# EAGLE design Static Test Pad (EAGLE 9.6.2)
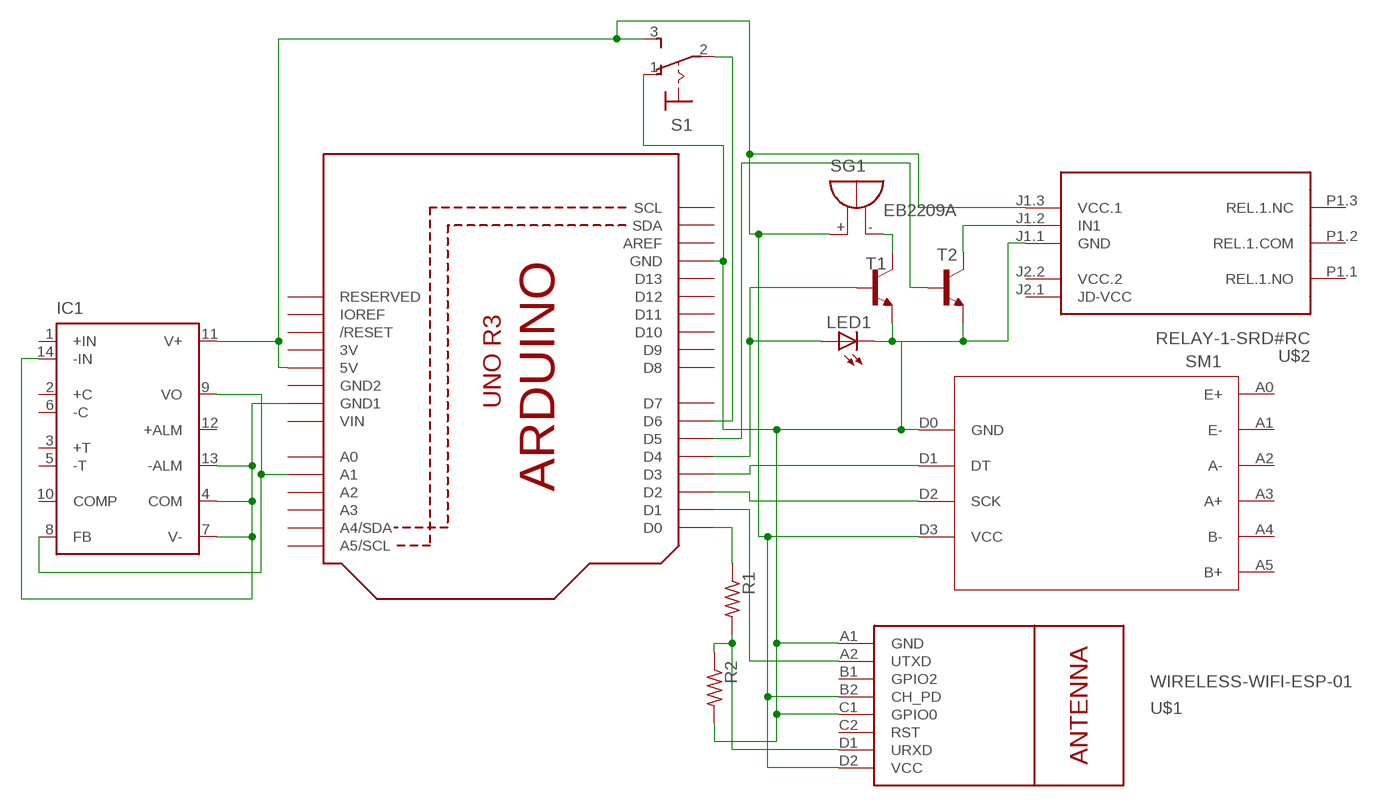
[diagram p0: schematic, sheet 1]

## Parts
IC1  AD595  [DIL14]
LED1  LEDB155  [Q62902-B155]
R1  FLIPFLOP-RES  [0805-THM]
R2  FLIPFLOP-RES  [0805-THM]
S1  320-916  [320-916]
SG1  EB2209A  [EB2209A]
SM1  HX711  [HX711]
T1  2N3700-NPN-TO18-EBC  [TO18]
T2  2N3700-NPN-TO18-EBC  [TO18]
U1  ARDUINOR3-BPLACE  [ARDUINOR3-BPLACE]
U$1  WIRELESS-WIFI-ESP-01  [WIRELESS-WIFI-ESP-01]
U$2  RELAY-1-SRD#RC  [RELAY-1-SRD#RC]

## Nets
N$1: IC1.8(FB) IC1.9(VO) U1.A1
N$2: IC1.4(COM) IC1.7(V-) IC1.13(-ALM) IC1.14(-IN) U1.GND1
N$3: S1.2(P) U1.D6
N$4: LED1.K(C) R2.2 S1.1(O) SM1.D0(GND) T1.1(E) T2.1(E) U1.GND U$1.A1(GND) U$1.C1(GPIO0) U$2.J1.1(GND)
N$5: SG1.- T1.3(C)
N$6: T2.2(B) U1.D5
N$7: LED1.A T1.2(B) U1.D4
N$8: R1.2 R2.1 U$1.D1(URXD)
N$9: U1.D1 U$1.A2(UTXD)
N$10: T2.3(C) U$2.J1.2(IN1)
N$11: SM1.D1(DT) U1.D3
N$12: SM1.D2(SCK) U1.D2
N$13: IC1.11(V+) S1.3(S) SG1.+ SM1.D3(VCC) U1.5V U$1.B2(CH_PD) U$1.D2(VCC) U$2.J1.3(VCC.1)
N$14: R1.1 U1.D0
Unconnected: IC1.1(+IN) IC1.2(+C) IC1.3(+T) IC1.5(-T) IC1.6(-C) IC1.10(COMP) IC1.12(+ALM) SM1.A0(E+) SM1.A1(E-) SM1.A2(A-) SM1.A3(A+) SM1.A4(B-) SM1.A5(B+) U1.A0 U1.A2 U1.A3 U1.A4(A4/SDA) U1.A5(A5/SCL) U1.AREF U1.D7 U1.D8 U1.D9 U1.D10 U1.D11 U1.D12 U1.D13 U1.IOREF U1.RESERVED U1.RESET(/RESET) U1.SCL U1.SDA U$1.B1(GPIO2) U$1.C2(RST) U$2.J2.1(JD-VCC) U$2.P1.1(REL.1.NO) U$2.P1.2(REL.1.COM) U$2.P1.3(REL.1.NC)

## Power pins joined to a net without a drawn wire
3V: U1.3V
GND2: U1.GND2
VCC.2: U$2.J2.2(VCC.2)
VIN: U1.VIN

## Library data of the parts
IC1 = analog-devices:AD595: ANALOG DEVICES; MPN: AD595AQ; OC_FARNELL: 409194; OC_NEWARK: 06WX1596
LED1 = adafruit:LED: LED OSRAM: - CHIPLED LG R971, LG N971, LY N971, LG Q971, LY Q971, LO R971, LY R971 LH N974, LH R974 LS Q976, LO Q976, LY Q976 LO Q996 - Hyper CHIPLED LW Q18S LB Q993, LB Q99A, LB R99A - SideLED LS A670, LO A670, LY A670, LG A670, LP A670 LB A673, LV A673, LT A673, LW A673 LH A674 LY A675 LS A676, LA A676, LO A676, LY A676, LW A676 LS A679, LY A679, LG A679 - Hyper Micro SIDELED® LS Y876, LA Y876, LO Y876, LY Y876 LT Y87S - SmartLED LW L88C, LW L88S LB L89C, LB L89S, LG L890 LS L89K, LO L89K, LY L89K LS L896, LA L896, LO L896, LY L896 - TOPLED LS T670, LO T670, LY T670, LG T670, LP T670 LSG T670, LSP T670, LSY T670, LOP T670, LYG T670 LG T671, LOG T671, LSG T671 LB T673, LV T673, LT T673, LW T673 LH T674 LS T676, LA T676, LO T676, LY T676, LB T676, LH T676, LSB T676, LW T676 LB T67C, LV T67C, LT T67C, LS T67K, LO T67K, LY T67K, LW E67C LS E67B, LA E67B, LO E67B, LY E67B, LB E67C, LV E67C, LT E67C LW T67C LS T679, LY T679, LG T679 LS T770, LO T770, LY T770, LG T770, LP T770 LB T773, LV T773, LT T773, LW T773 LH T774 LS E675, LA E675, LY E675, LS T675 LS T776, LA T776, LO T776, LY T776, LB T776 LHGB T686 LT T68C, LB T68C - Hyper Mini TOPLED® LB M676 - Mini TOPLED Santana® LG M470 LS M47K, LO M47K, LY M47K Source: http://www.osram.convergy.de/
R1 R2 = adafruit:FLIPFLOP-RES: Flip Flop resistor An 0805 resistor inside a standard 1/4W 5% resistor. Makes for easy mods
S1 = switch:320-916: TOGGLE SWITCH distributor RS Components
SG1 = buzzer:EB2209A: BUZZER Source: Buerklin; OC_FARNELL: unknown; OC_NEWARK: unknown
SM1 = hx711 a:HX711: HX711 module is a Load Cell Amplifier breakout board for the HX711 IC that allows you to easily read load cells to measure weight. This module uses 24 high precision A/D converter chip HX711. It is a specially designed for the high precision electronic scale design, with two analog input channel, the internal integration of 128 times the programmable gain amplifier. The input circuit can be configured to provide a bridge type pressure bridge (such as pressure, weighing sensor mode), is of high precision, low cost is an ideal sampling front-end module.
T1 T2 = transistor:*-NPN-: NPN Transistror BF959 corrected 2008.03.06
U1 = adafruit:ARDUINOR3: This is a new object for the new Arduino R3 - with extra pins that you may want to use (such as IOref, and duplicated A4/A5
U$1 = HC SR04:WIRELESS-WIFI-ESP-01: Wireless Wi-Fi ESP-01 Module based on ESP8266 chip Click here to find device on ebay.com <http://www.ebay.com/sch/esp8266+esp+01+transceiver>
U$2 = HC SR04:RELAY-1-SRD#RC: 1-Channel Relay Module based on SRD-05VDC-SL-C relays Symbol with relays pins Click here to find device on ebay.com <http://www.ebay.com/sch/one+channel+isolated+relay+5v>

## Board
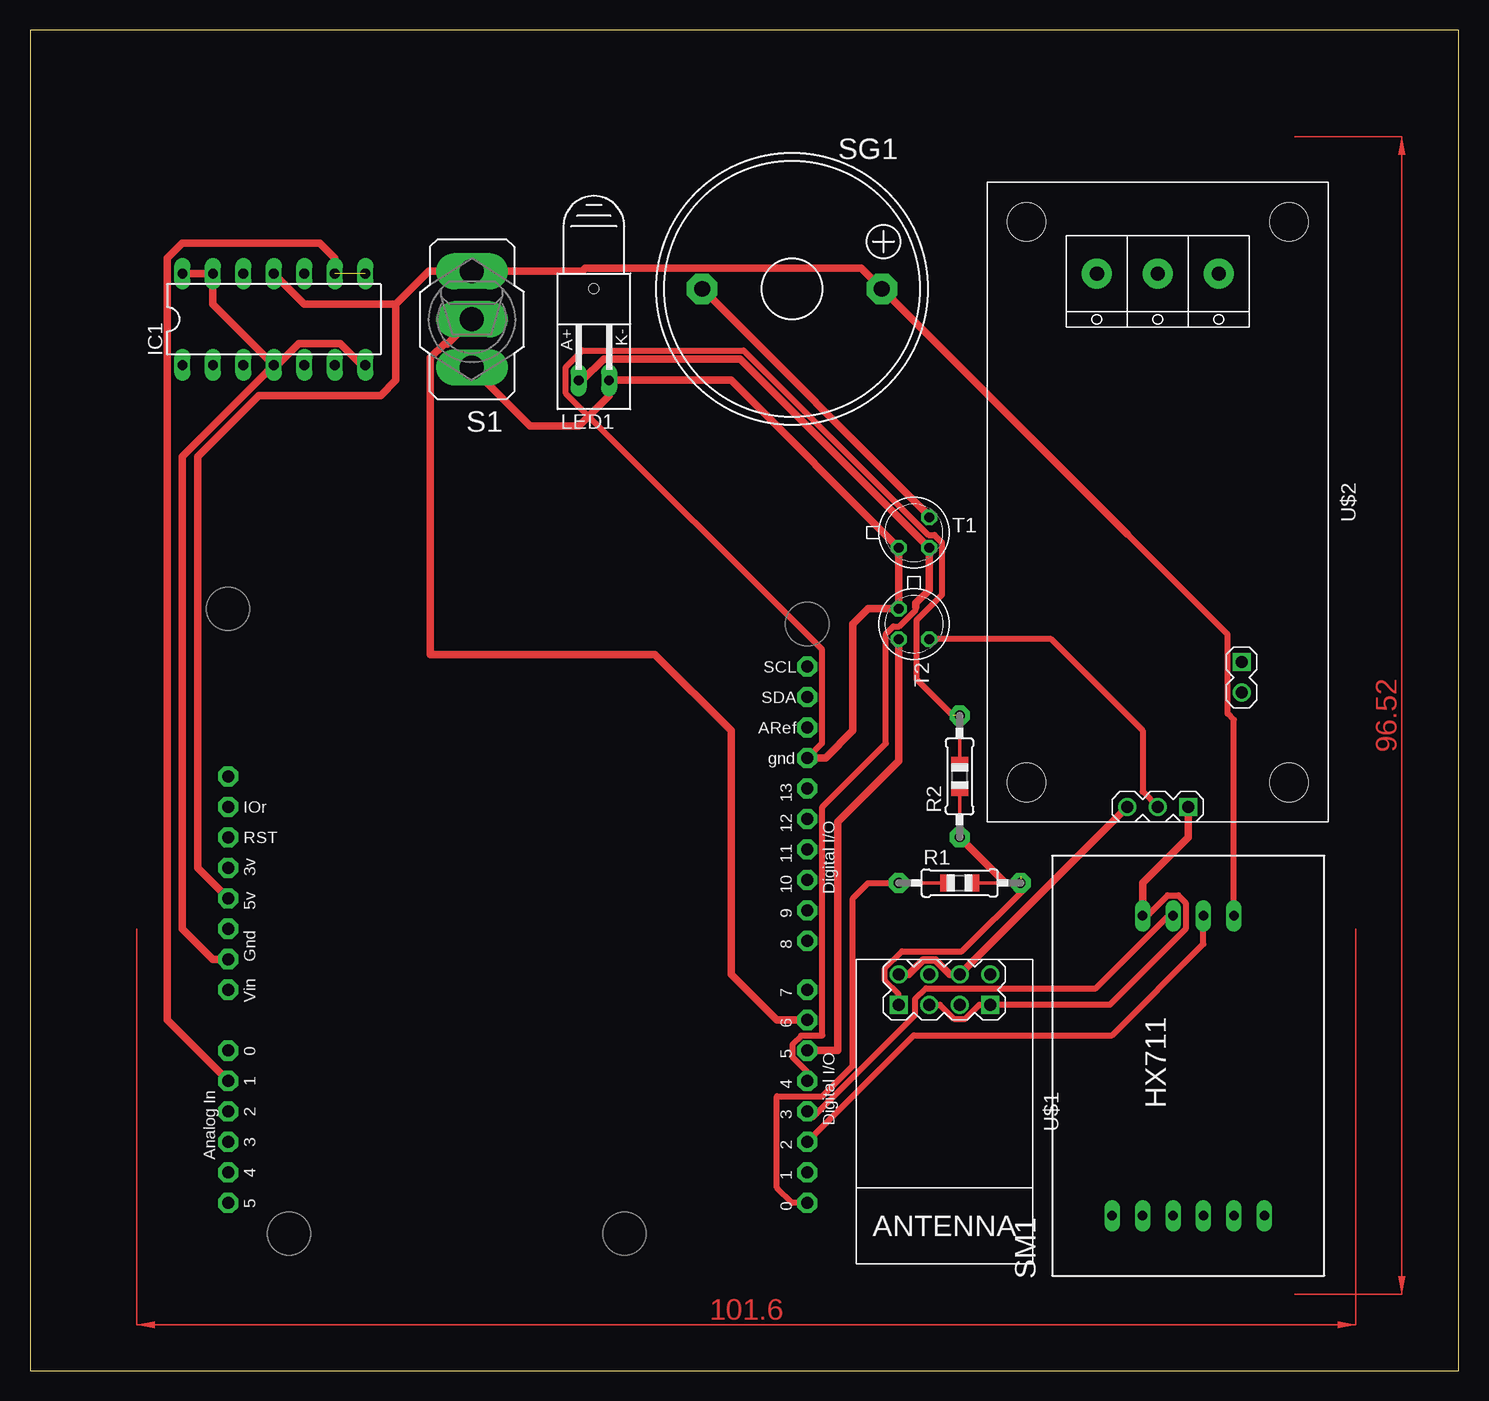
[diagram p1: board, top side]
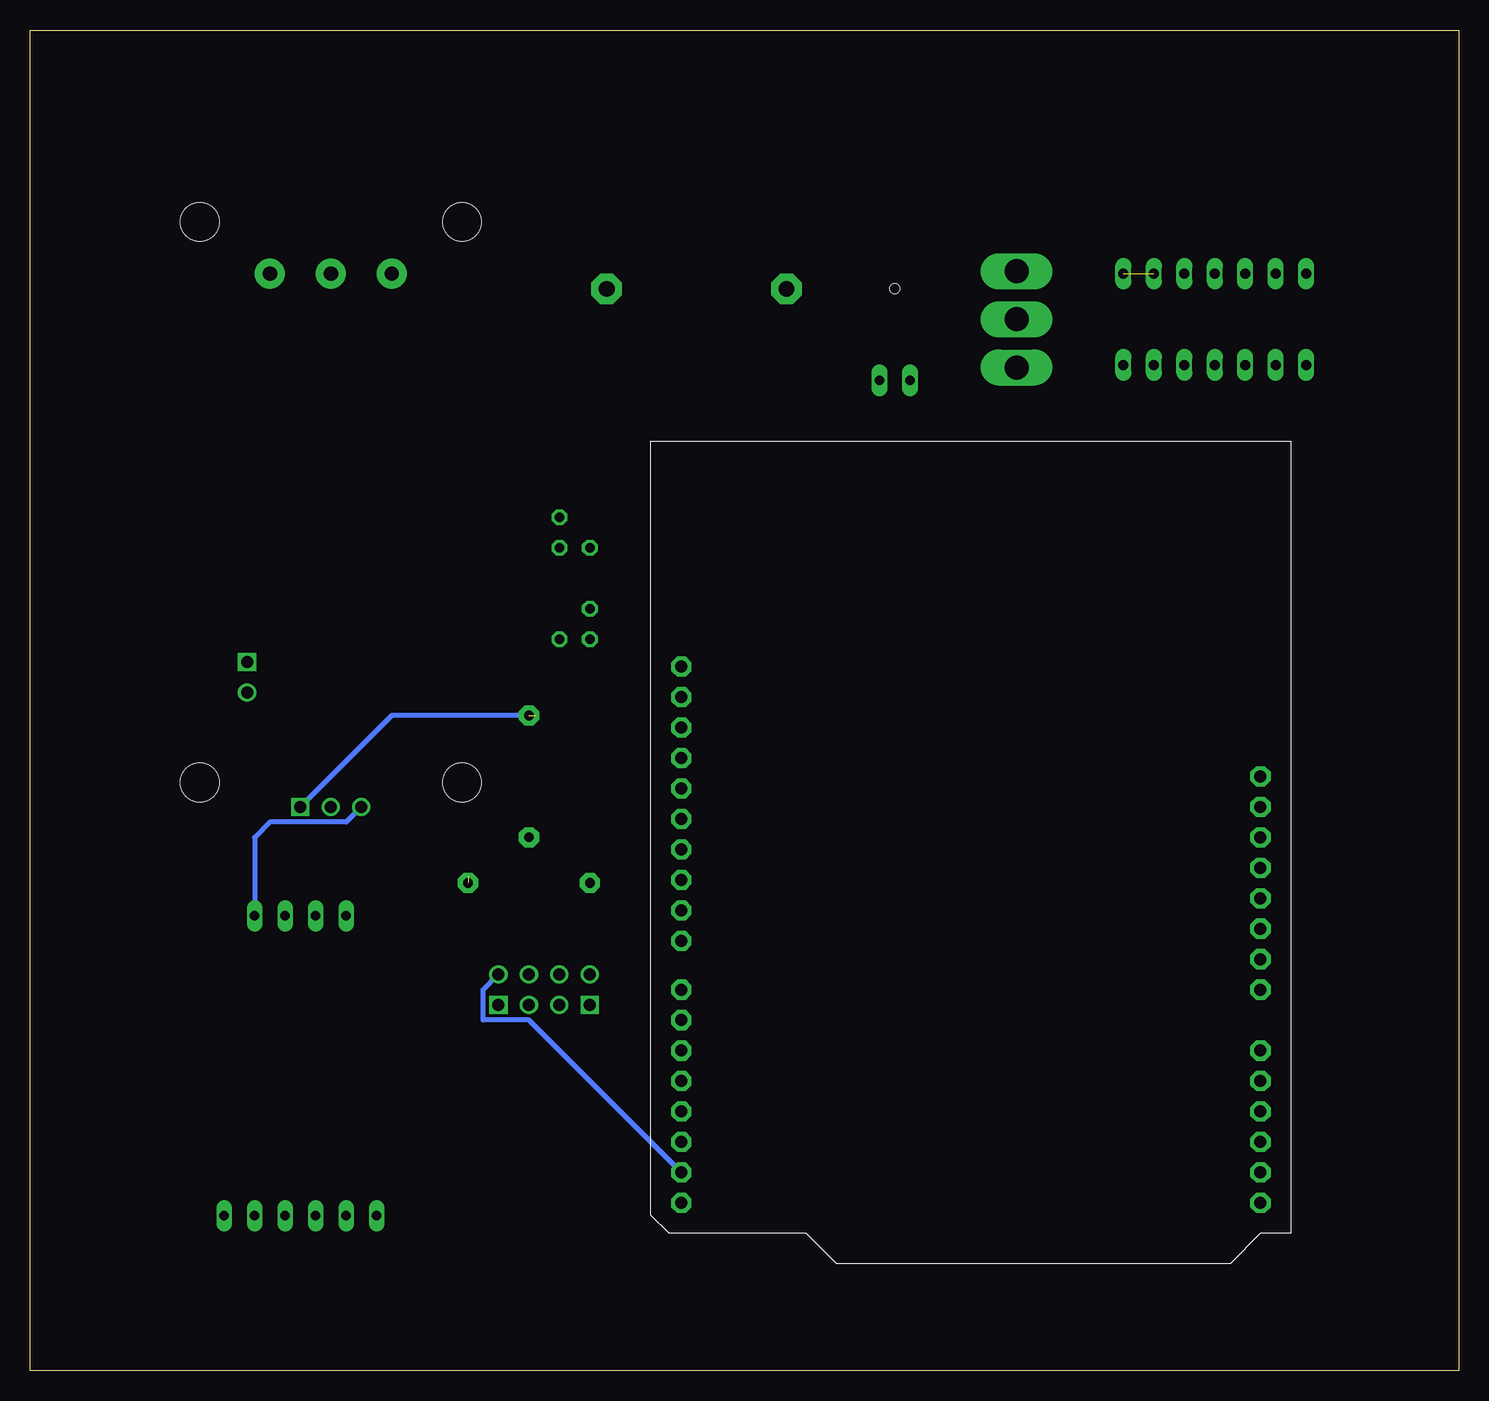
[diagram p2: board, bottom side, seen from below]

Size 119.05 x 111.75 mm. Coordinates in mm from the lower left corner, seen from the top.
Outline: 0,0 119.05,0 119.05,111.75 0,111.75 0,0
Copper layers (1*16): Top 0.035mm / dielectric 1.5mm / Bottom 0.035mm
Design rules "default": minimum track width 6mil, minimum drill 0.35mm, track to track 6mil, track to pad 6mil, pad to pad 6mil, via to via 6mil, smd to smd 6mil, copper to edge 40mil, drill to drill 6mil, minimum pad ring 10mil, minimum via ring 8mil, stop-mask expansion 4mil, vias tented up to drill 0mil, thermal gap 10mil

### Footprints (pad centres in the part's own frame; a part is rotated, then mirrored left to right if it is on the bottom)
DIL14 = drill 0.813 long: 1 -7.62,-3.81; 2 -5.08,-3.81; 3 -2.54,-3.81; 4 0,-3.81; 5 2.54,-3.81; 6 5.08,-3.81; 7 7.62,-3.81; 8 7.62,3.81; 9 5.08,3.81; 10 2.54,3.81; 11 0,3.81; 12 -2.54,3.81; 13 -5.08,3.81; 14 -7.62,3.81
Q62902-B155 = drill 0.813 long: A 7.62,-1.27; K 7.62,1.27 | hole 0.813: 0,0
0805-THM = drill 0.813 pad 1.676 octagon: 1 -5.08,0; 2 5.08,0
320-916 = drill 2.007 long: 1 0,4.013; 2 0,0; 3 0,-4.013
EB2209A = drill 1.321 pad 2.54 octagon: + 7.493,0; - -7.493,0
HX711 = drill 0.8 long: A0 -12.5,6.35; A1 -12.5,3.81; A2 -12.5,1.27; A3 -12.5,-1.27; A4 -12.5,-3.81; A5 -12.5,-6.35; D0 12.5,3.81; D1 12.5,1.27; D2 12.5,-1.27; D3 12.5,-3.81
TO18 = drill 0.813 octagon: 1 -1.27,-1.27; 2 1.27,-1.27; 3 1.27,1.27
ARDUINOR3-BPLACE = drill 1 pad 1.676 octagon: 3V 35.56,2.54; 5V 38.1,2.54; A0 50.8,2.54; A1 53.34,2.54; A2 55.88,2.54; A3 58.42,2.54; A4 60.96,2.54; A5 63.5,2.54; AREF 23.876,50.8; D0 63.5,50.8; D1 60.96,50.8; D2 58.42,50.8; D3 55.88,50.8; D4 53.34,50.8; D5 50.8,50.8; D6 48.26,50.8; D7 45.72,50.8; D8 41.656,50.8; D9 39.116,50.8; D10 36.576,50.8; D11 34.036,50.8; D12 31.496,50.8; D13 28.956,50.8; GND 26.416,50.8; GND1 43.18,2.54; GND2 40.64,2.54; IOREF 30.48,2.54; RESERVED 27.94,2.54; RESET 33.02,2.54; SCL 18.796,50.8; SDA 21.336,50.8; VIN 45.72,2.54
WIRELESS-WIFI-ESP-01 = drill 1 square: A1 -8.89,3.81; D1 -8.89,-3.81 | drill 1: A2 -11.43,3.81; B1 -8.89,1.27; B2 -11.43,1.27; C1 -8.89,-1.27; C2 -11.43,-1.27; D2 -11.43,-3.81
RELAY-1-SRD#RC = drill 1 square: J1.1 25.4,2.54; J2.1 13.335,6.985 | drill 1: J1.2 25.4,0; J1.3 25.4,-2.54; J2.2 15.875,6.985 | drill 1.2 pad 2.5: P1.1 -19.05,5.08; P1.2 -19.05,0; P1.3 -19.05,-5.08 | hole 3.2: -23.368,10.922; 23.368,10.922; 23.368,-10.922; -23.368,-10.922

### Placement (x,y rotation side)
IC1  20.32,87.63 0 top
LED1  46.99,90.17 270 top
R1  77.47,40.64 0 top
R2  77.47,49.53 90 top
S1  36.83,87.63 180 top
SG1  63.5,90.17 0 top
SM1  96.52,25.4 90 top
T1  73.66,69.85 0 top
T2  73.66,62.23 270 top
U1  13.97,77.47 270 top
U$1  76.2,21.59 270 top
U$2  93.98,72.39 270 top

### Tracks (layer width: path | path; a pad name or v marks a point on that pad's centre or on a via)
N$1  (1 unrouted)
  Top 0.61: U1.A1 11.43,29.21 11.43,92.71 12.7,93.98 24.13,93.98 25.4,92.71 IC1.9
N$2
  Top 0.61: IC1.14 IC1.13 15.24,88.9 IC1.4 | IC1.4 20.62,83.82 22.4,85.6 25.86,85.6 27.64,83.82 IC1.7 | IC1.4 12.7,76.2 12.7,36.83 15.24,34.29 U1.GND1
N$3
  Top 0.61: S1.2 34.78,85.58 34.51,85.58 33.36,84.43 33.36,60.96 33.36,60.62 33.36,59.69 52.07,59.69 58.42,53.34 58.42,33.02 62.23,29.21 U1.D6
N$4  (1 unrouted)
  Top 0.508: SM1.D0 93.1,37.9 94.81,39.61 95.69,39.61 96.31,38.99 96.31,36.81 89.98,30.48 U$1.A1 79.11,30.48 77.95,29.32 76.99,29.32 75.83,30.48 U$1.C1 | U1.GND 66.02,52.3 66.02,60.09 44.65,81.45 44.65,83.65 46.04,85.04 59.48,85.04 74.87,69.65 75.37,69.65 76,69.02 76,64.66 73.86,62.53 73.86,57.66 76.91,54.61
  Top 0.61: S1.1 41.71,78.74 45.72,78.74 48.26,81.28 LED1.K 58.42,82.55 T1.1 T2.1 69.85,63.5 68.58,62.23 68.58,53.34 66.29,51.05 U1.GND | SM1.D0 92.71,40.64 96.52,44.45 U$2.J1.1
  Bottom 0.406: R2.2 88.9,54.61 U$2.J1.1
N$5
  Top 0.61: SG1.- 74.93,71.25 T1.3
N$6
  Top 0.61: T2.2 72.39,50.8 67.31,45.72 67.31,26.67 U1.D5
N$7
  Top 0.508: U1.D4 64.77,24.91 63.52,26.15 63.52,27.19 64.25,27.92 66.02,27.92 66.04,27.94 66.04,46.99 71.32,52.27 71.32,61.4 71.95,62.03 72.42,62.03 73.81,63.41 73.81,63.65
  Top 0.61: LED1.A 46.02,82.55 47.8,84.33 59.18,84.33 T1.2 74.93,65.08 73.81,63.96 73.81,63.65
N$8  (1 unrouted)
  Top 0.508: 82.55,41.2 82.8,41.2 83.13,40.87 83.13,40.41 77.66,34.94 72.67,34.94 71.23,33.5 71.23,32.54 72.39,31.38 U$1.D1
  Top 0.61: R2.1 81.28,40.64 R1.2
N$9
  Top 0.508: 80.38,33.02 U$1.A2 80.26,32.77
  Bottom 0.406: U1.D1 77.47,29.21 81.28,29.21 81.28,31.75 U$1.A2
N$10
  Top 0.508: U$2.J1.2 92.71,48.26 92.71,53.34 85.09,60.96 T2.3
N$11
  Top 0.508: U1.D3 65.24,21.12 73.77,29.66 73.77,30.96 74.67,31.86 88.82,31.86 94.86,37.9 SM1.D1
N$12
  Top 0.508: U1.D2 73.66,27.94 90.17,27.94 97.79,35.56 SM1.D2
N$13
  Top 0.508: SM1.D3 100.33,54.24 99.81,54.76 99.81,61.36 91.44,69.72
  Top 0.61: IC1.11 22.86,88.9 30.48,88.9 | 30.48,88.9 33.22,91.64 S1.3 46.02,91.64 46.27,91.9 69.27,91.9 SG1.+ 91.44,69.72 | U1.5V 13.97,41.91 13.97,76.2 19.05,81.28 29.21,81.28 30.48,82.55 30.48,88.9 | U$1.D2 73.22,33.02 74.43,34.23 75.43,34.23 76.64,33.02 U$1.B2 U$2.J1.3
  Bottom 0.406: U$2.J1.3 92.71,45.72 99.06,45.72 100.33,44.45 SM1.D3
N$14
  Top 0.508: U1.D0 63.5,13.97 62.23,15.24 62.23,22.86 66.04,22.86 68.58,25.4 68.58,39.37 69.85,40.64 R1.1
(copper drawn outside any net)
  shapes: Top area x2